# Altium schematic sheet SensorSheet.SchDoc
size A4
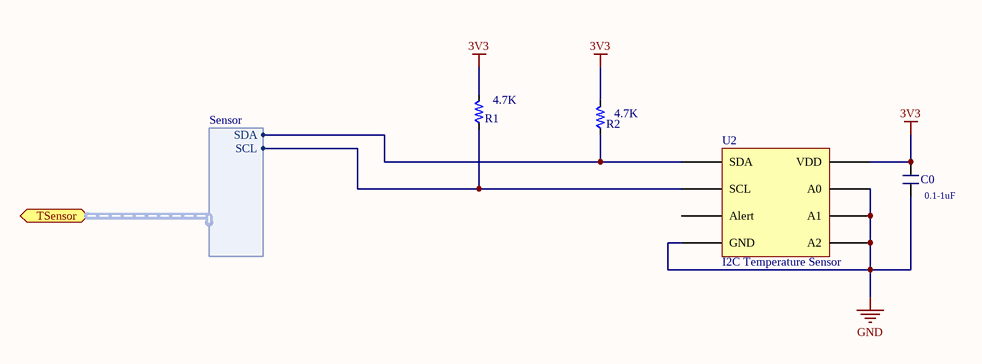
[diagram p0: SensorSheet.SchDoc]

## Parts
C0  Capacitance: 0.1-1uF  [PCB_GENERIC_SMD_0603]  (hidden comment: SCH_GENERIC_CAPACITOR_0603)
R1  Resistance: 4.7K  [PCB_GENERIC_SMD_0603]  (hidden comment: SCH_GENERIC_RESISTOR_0603)
R2  Resistance: 4.7K  [PCB_GENERIC_SMD_0603]  (hidden comment: SCH_GENERIC_RESISTOR_0603)
U2  I2C Temperature Sensor  [SENSOR TEMP I2C/SMBUS 8MSOP]

## Ports
TSensor (harness Sensor)

## Harnesses
Sensor: SCL, SDA

## Nets
3V3: C0.2 R1.2 R2.2 U2.8(VDD)
GND: C0.1 U2.4(GND) U2.5(A2) U2.6(A1) U2.7(A0)
NetR1_1: R1.1 U2.2(SCL) ; port TSensor.SCL
NetR2_1: R2.1 U2.1(SDA) ; port TSensor.SDA

Not connected (* = marked no-connect by the designer): U2 3(Alert)

## Library data of the parts
C0 = SCH_GENERIC_CAPACITOR_0603: Generic SMD capacitor 0603; Tolerance: *%
R1 R2 = SCH_GENERIC_RESISTOR_0603: Generic SMD resistor 0603
U2 = Temperature Sensor Digital, Local -40°C ~ 125°C 10 b 8-MSOP, Digikey; MCP9808T-E/MSCT-ND Mfg; MCP9808T-E/MS